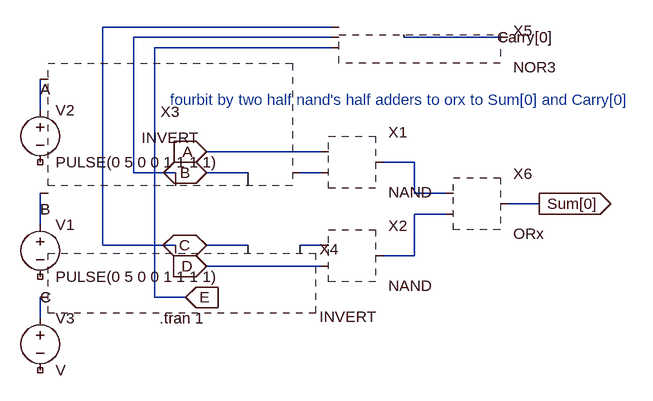
[diagram p0: schematic LabTwoRyanOates.asc]
LabTwoRyanOates.asc, the LTspice schematic file:
Version 4.1
SHEET 1 880 680
WIRE 112 -112 -240 -112
WIRE 112 -96 -192 -96
WIRE 384 -96 224 -96
WIRE 112 -80 -160 -80
WIRE -336 16 -336 -32
WIRE 96 80 -80 80
WIRE 240 96 192 96
WIRE -192 112 -192 -96
WIRE -128 112 -192 112
WIRE -16 112 -80 112
WIRE 96 112 64 112
WIRE 240 144 240 96
WIRE 288 144 240 144
WIRE 432 160 384 160
WIRE 288 176 240 176
WIRE -336 192 -336 144
WIRE -240 224 -240 -112
WIRE -128 224 -240 224
WIRE -16 224 -80 224
WIRE 96 224 64 224
WIRE 240 240 240 176
WIRE 240 240 192 240
WIRE 96 256 -80 256
WIRE -160 304 -160 -80
WIRE -112 304 -160 304
WIRE -336 336 -336 304
FLAG 432 160 Sum[0]
IOPIN 432 160 Out
FLAG -80 80 A
IOPIN -80 80 In
FLAG -80 256 D
IOPIN -80 256 In
FLAG -80 224 C
IOPIN -80 224 BiDir
FLAG -80 112 B
IOPIN -80 112 BiDir
FLAG -112 304 E
IOPIN -112 304 In
SYMBOL INVERT 16 224 R0
SYMATTR InstName X4
SYMBOL ORx 336 160 R0
SYMATTR InstName X6
SYMBOL INVERT 16 112 R0
WINDOW 39 8 4 Bottom 2
SYMATTR InstName X3
SYMBOL NAND 144 96 R0
SYMATTR InstName X1
SYMBOL NAND 144 240 R0
SYMATTR InstName X2
SYMBOL voltage -336 176 R0
WINDOW 123 0 0 Left 0
WINDOW 39 0 0 Left 0
SYMATTR InstName V1
SYMATTR Value PULSE(0 5 0 0 1 1 1 1)
SYMBOL voltage -336 0 R0
WINDOW 123 0 0 Left 0
WINDOW 39 0 0 Left 0
SYMATTR InstName V2
SYMATTR Value PULSE(0 5 0 0 1 1 1 1)
SYMBOL voltage -336 320 R0
SYMATTR InstName V3
SYMBOL NOR3 144 -96 R0
SYMATTR InstName X5
TEXT -152 336 Left 2 !.tran 1
TEXT -136 0 Left 2 ;fourbit by two half nand's half adders to orx to Sum[0] and Carry[0]
TEXT -336 -16 Left 2 !A
TEXT -336 168 Left 2 !B
TEXT 368 -96 Left 2 !Carry[0]
TEXT -336 304 Left 2 !C

The netlist it stands for:
* LabTwoRyanOates.asc
* X4: INVERT (symbol INVERT not available, pin order unknown); nets seen at it: C, N001, N009, N010
* X6: ORx (symbol ORx not available, pin order unknown); nets seen at it: N005, N007, Sum[0]
* X3: INVERT (symbol INVERT not available, pin order unknown); nets seen at it: B, N002, N004, N006, N008
* X1: NAND (symbol NAND not available, pin order unknown); nets seen at it: A, N005, N006
* X2: NAND (symbol NAND not available, pin order unknown); nets seen at it: D, N007, N009
V1 N008 NC_01 PULSE(0 5 0 0 1 1 1 1)
V2 N004 NC_02 PULSE(0 5 0 0 1 1 1 1)
V3 N010 NC_03 V
* X5: NOR3 (symbol NOR3 not available, pin order unknown); nets seen at it: E, N001, N002, N003
.tran 1
* fourbit by two half nand's half adders to orx to Sum[0] and Carry[0]
A
B
Carry[0]
C
.backanno
.end